# Altium schematic sheet power.SchDoc
size A4
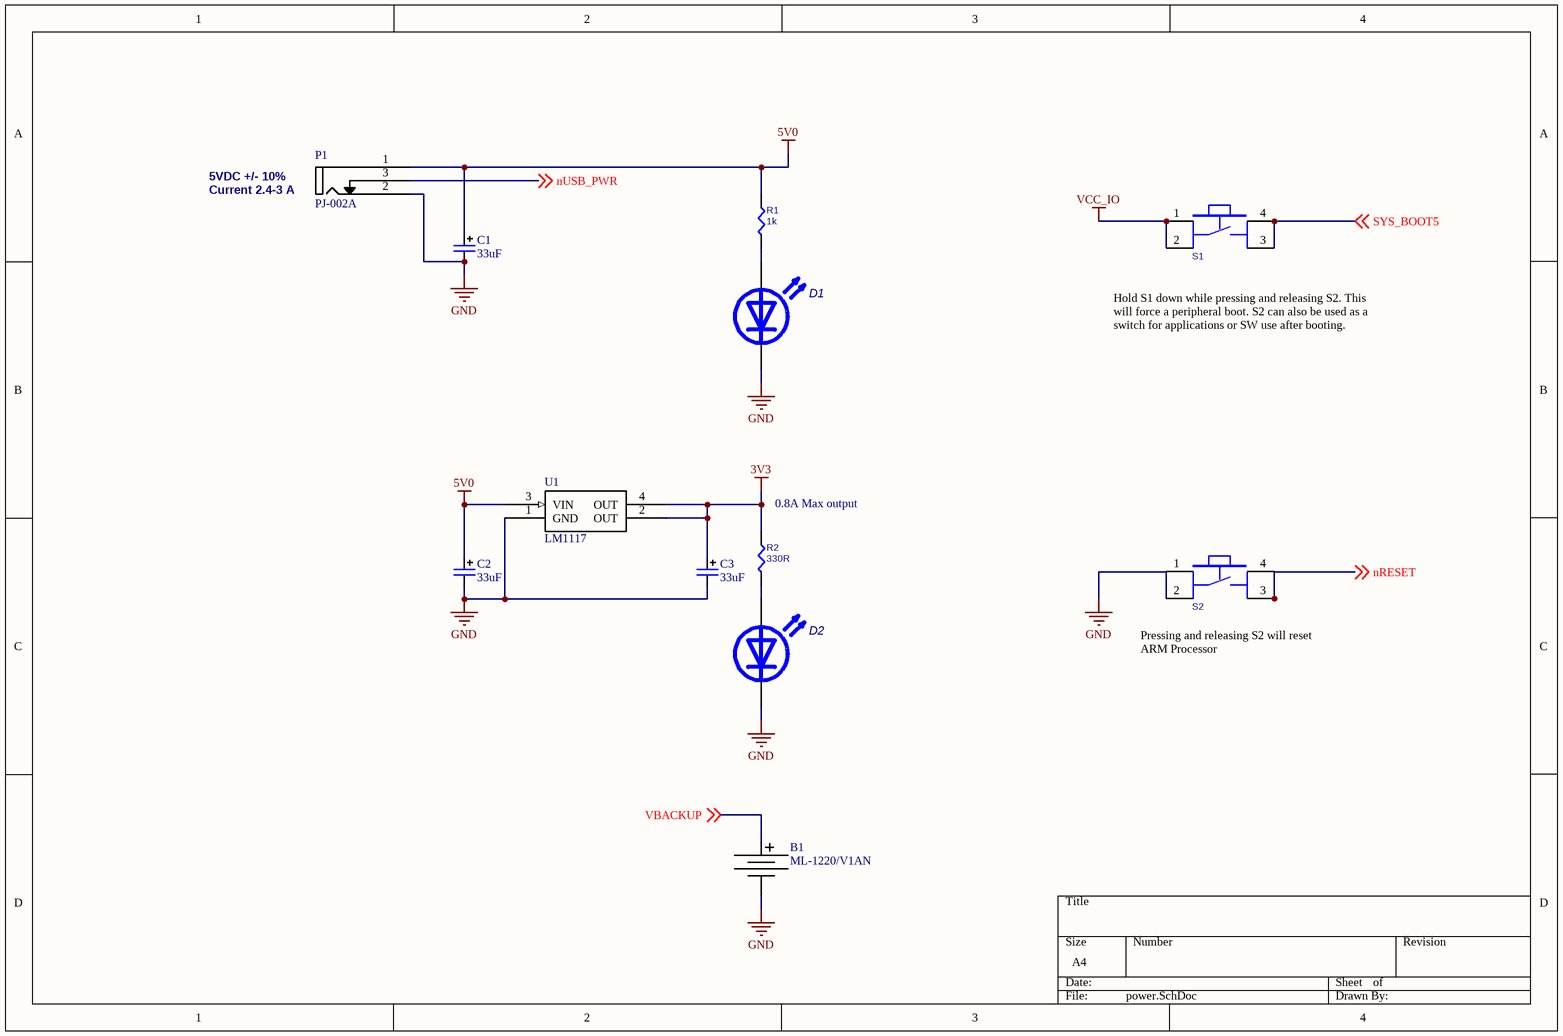
[diagram p0: power.SchDoc]

## Parts
B1  ML-1220/V1AN  [ML1220-V1AN]
C1  value 33uF  [B]  (hidden comment: CAP B)
C2  value 33uF  [B]  (hidden comment: CAP B)
C3  value 33uF  [B]  (hidden comment: CAP B)
D1  LED0805  [LED0805]  (value not drawn)
D2  LED0805  [LED0805]  (value not drawn)
P1  PJ-002A  [PJ-002A]
R1  value 1k  [CHIP0603]  (hidden comment: R0603)
R2  value 330R  [CHIP0603]  (hidden comment: R0603)
S1  SWT-32  [SWT-32]  (value not drawn)
S2  SWT-32  [SWT-32]  (value not drawn)
U1  LM1117  [SOT223]

## Nets
3V3: C3.1 R2.2 U1.2(OUT) U1.4(OUT)
5V0: C1.1 C2.1 P1.1(GND) R1.2 U1.3(VIN)
GND: B1.2 C1.2 C2.2 C3.2 D1.2(C) D2.2(C) P1.2(RIGHT) S2.1 S2.2 U1.1(GND)
VCC_IO: S1.1 S1.2
nRESET: S2.3 S2.4 ; off-sheet nRESET
nUSB_PWR: P1.3(LEFT) ; off-sheet nUSB_PWR
SYS_BOOT5: S1.3 S1.4 ; off-sheet SYS_BOOT5
VBACKUP: B1.1 ; off-sheet VBACKUP
NetD1_1: D1.1(A) R1.1
NetD2_1: D2.1(A) R2.1

## Notes on the sheet
- 5VDC +/- 10%
  Current 2.4-3 A
- (near S1) Hold S1 down while pressing and releasing S2. This
  will force a peripheral boot. S2 can also be used as a
  switch for applications or SW use after booting.
- (near R2) 0.8A Max output
- (near S2) Pressing and releasing S2 will reset ARM Processor

## Library data of the parts
B1 = ML-1220/V1AN: BATTERY LITHIUM 3V RECHARGE PC PINS; Manufacturer: Panasonic; Man P/N: ML-1220/V1AN
C1-C3 = CAP B: Tantalum capacitor. Case B
D1 D2 = LED0805: LED 0805; Value: *
P1 = PJ-002A: DC POWER JACK; Manufacturer: CIU Inc; Vendor: Digi-key; Alternative P/N: DJK-02A; Man P/N: PJ-002A
R1 R2 = R0603: Resistor 0603
S1 S2 = SWT-32: Push button; Vendor: brownbear.ru; Man P/N: SWT-32
U1 = LM1117: 800mA Low-Dropout Linear Regulator; Manufacturer: National; Man P/N: LM1117IMPX-3.3; Package: 3-lead  SOT-223